# Altium schematic sheet LT3652EDD#PBF.schdoc
size 57 x 60 mm
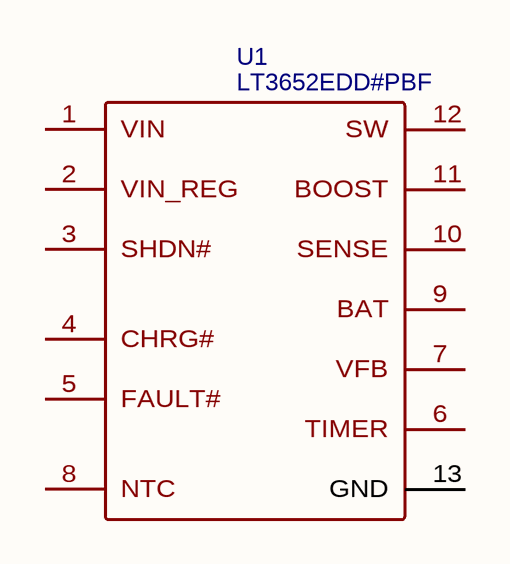
[diagram p0: LT3652EDD#PBF.schdoc]

## Parts
U1  LT3652EDD#PBF  [DFN-12_L3.0-W3.0-P0.50-LS3.0-BL-EP]

## Nets

Not connected (* = marked no-connect by the designer): U1 1(VIN) 2(VIN_REG) 3(SHDN#) 4(CHRG#) 5(FAULT#) 6(TIMER) 7(VFB) 8(NTC) 9(BAT) 10(SENSE) 11(BOOST) 12(SW) 13(GND)

## Library data of the parts
U1 = LT3652EDD#PBF: Manufacturer: ADI(亚德诺); Supplier: LCSC; Manufacturer Part: LT3652EDD#PBF; Supplier Part: C96510; JLCPCB Part Class: Extended Part; spicePre: U; spiceSymbolName: LT3652EDD#PBF